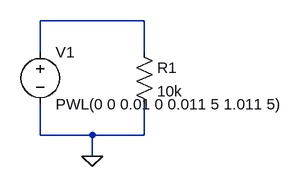
[diagram p0: schematic Draft1.asc]
Draft1.asc, the LTspice schematic file:
Version 4.1
SHEET 1 880 680
WIRE 224 64 64 64
WIRE 64 112 64 64
WIRE 224 112 224 64
WIRE 64 240 64 192
WIRE 144 240 64 240
WIRE 224 240 224 192
WIRE 224 240 144 240
WIRE 144 272 144 240
FLAG 144 272 0
SYMBOL voltage 64 96 R0
WINDOW 123 0 0 Left 0
WINDOW 39 0 0 Left 0
SYMATTR InstName V1
SYMATTR Value PWL(0 0 0.01 0 0.011 5 1.011 5)
SYMBOL res 208 96 R0
SYMATTR InstName R1
SYMATTR Value 10k

The netlist it stands for:
* Draft1.asc
V1 N001 0 PWL(0 0 0.01 0 0.011 5 1.011 5)
R1 N001 0 10k
.backanno
.end